# Altium schematic sheet Power+ICs.SchDoc
size 431 x 279 mm; SheetNumber: 1; SheetTotal: 1
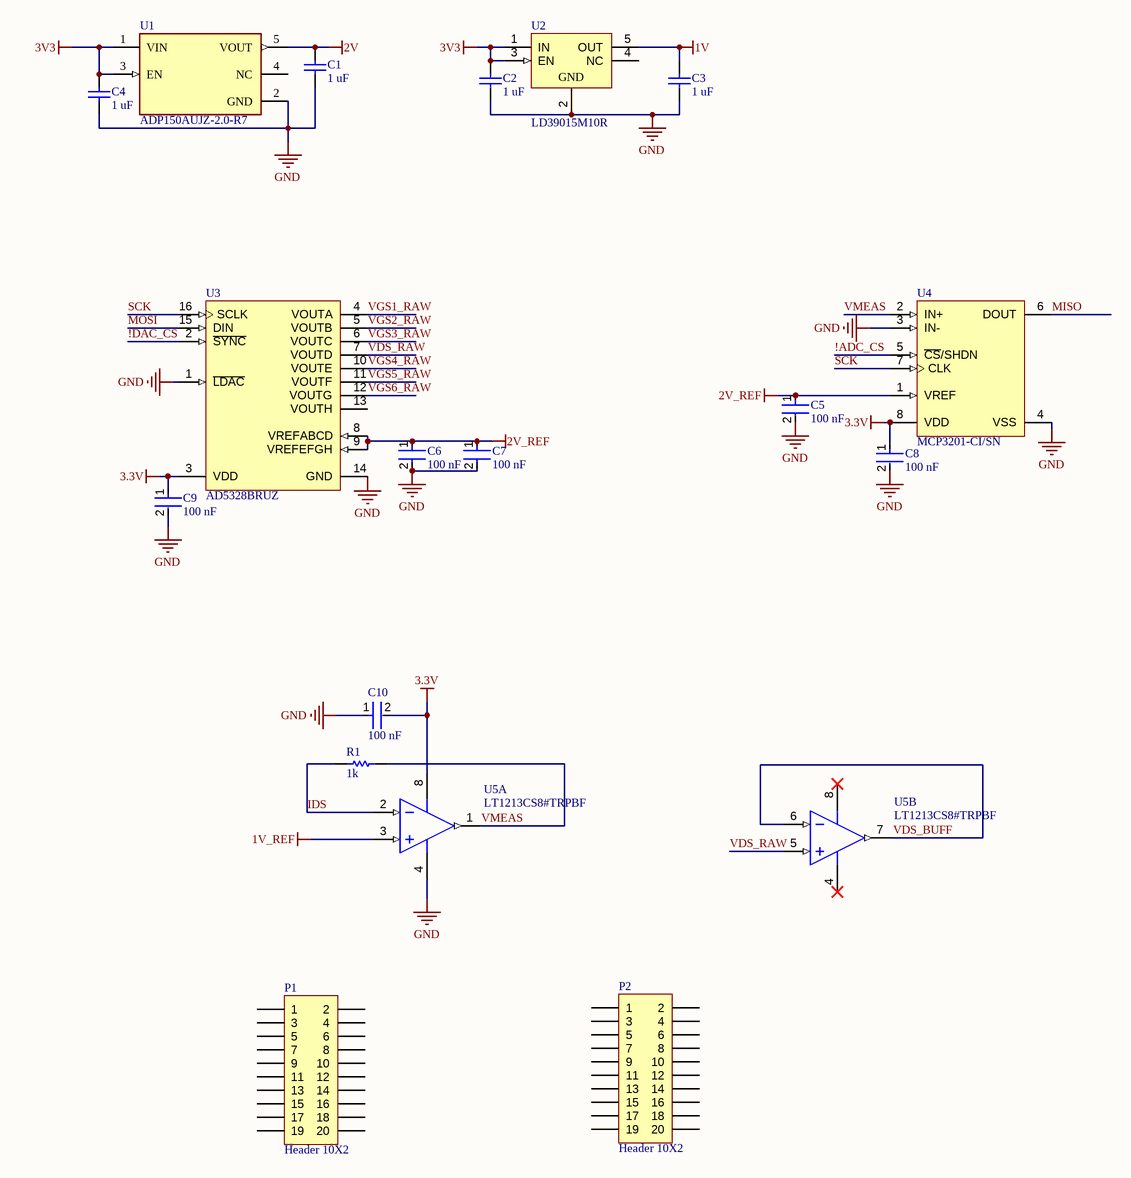
[diagram p0: Power+ICs.SchDoc]

## Parts
C1  1 uF  [CAPC2013X135X45LL10T25]
C2  1 uF  [CAPC2013X135X45LL10T25]
C3  1 uF  [CAPC2013X135X45LL10T25]
C4  1 uF  [CAPC2013X135X45LL10T25]
C5  100 nF  [FP-C0805C-DN-MFG]
C6  100 nF  [FP-C0805C-DN-MFG]
C7  100 nF  [FP-C0805C-DN-MFG]
C8  100 nF  [FP-C0805C-DN-MFG]
C9  100 nF  [FP-C0805C-DN-MFG]
C10  100 nF  [FP-C0805C-DN-MFG]
P1  Header 10X2  [HDR2X10]
P2  Header 10X2  [HDR2X10]
R1  1k  [RESC2013X55X40LL15T20]
U1  ADP150AUJZ-2.0-R7  [FP-UJ-5-IPC_B]
U2  LD39015M10R  [SOT23-5L_M]
U3  AD5328BRUZ  [RU-16_L]
U4  MCP3201-CI/SN  [SOIC-SN8_L]
U5  LT1213CS8#TRPBF  [LT-S8-8_N]  (parts A,B of 2)

## Nets
1V: C3.2 U2.5(OUT)
1V_REF: U5.3(+IN_A)
2V: C1.2 U1.5(VOUT)
2V_REF: C5.1 C6.1 C7.1 U3.8(VREFABCD) U3.9(VREFEFGH) U4.1(VREF)
3.3V: C8.1 C9.1 C10.2 U3.3(VDD) U4.8(VDD) U5.8(V+)
3V3: C2.2 C4.2 U1.1(VIN) U1.3(EN) U2.1(IN) U2.3(EN)
GND: C1.1 C2.1 C3.1 C4.1 C5.2 C6.2 C7.2 C8.2 C9.2 C10.1 U1.2(GND) U2.2(GND) U3.1(~{LDAC}) U3.14(GND) U4.3(IN-) U4.4(VSS) U5.4(V-)
!ADC_CS: U4.5(~{CS}/SHDN)
!DAC_CS: U3.2(~{SYNC})
IDS: R1.1 U5.2(-IN_A)
MISO: U4.6(DOUT)
MOSI: U3.15(DIN)
SCK: U3.16(SCLK) U4.7(CLK)
VDS_BUFF: U5.6(-IN_B) U5.7(OUT_B)
VDS_RAW: U3.7(VOUTD) U5.5(+IN_B)
VGS1_RAW: U3.4(VOUTA)
VGS2_RAW: U3.5(VOUTB)
VGS3_RAW: U3.6(VOUTC)
VGS4_RAW: U3.10(VOUTE)
VGS5_RAW: U3.11(VOUTF)
VGS6_RAW: U3.12(VOUTG)
VMEAS: R1.2 U4.2(IN+) U5.1(OUT_A)

Not connected (* = marked no-connect by the designer): P1 1 2 3 4 5 6 7 8 9 10 11 12 13 14 15 16 17 18 19 20; P2 1 2 3 4 5 6 7 8 9 10 11 12 13 14 15 16 17 18 19 20; U1 4(NC); U2 4(NC); U3 13(VOUTH)

## Notes on the sheet
- DWG. NO.
- REV.
- SHT.
- THIS DOCUMENT AND THE DATA DISCLOSED HEREIN OR HEREWITH IS THE PROPERTY OF ALTIUM LIMITED AND MAY BE FREELY DISTRIBUTED IN WHOLE. NO RIGHTS ARE RESERVED OR EXPRESS OR IMPLIED WARANTEE GIVEN.
- REVISION
- DESCRIPTION
- DATE
- APPROVED
- ENG:
- APPROVALS
- PROJECT
- DSN:
- CHK:
- REFERENCE DOCUMENTS
- PROJECT REVISION:
- TITLE
- DOCUMENT REVISION:
- DESIGN ITEM:
- BOM:
- FAB DWG:
- PCB DWG:
- ASSY DWG:
- SCALE:
- SIZE
- B
- CAGE CODE
- FILE NAME
- DWG NO.
- SHEET
- OF
- REV

## Library data of the parts
C1-C4 = CMP-1036-04761-2: Manufacturer: Murata; Part Number: GRM21BR71H105KA12L
C5-C10 = CMP-2007-00279-2: CAP CER 0.1UF 50V X7R 0805; Manufacturer Part Number: C0805C104K5RACTU; Manufacturer: KEMET; Value: 0.10 μF; Tolerance: 0.1; Temperature Coefficient: 30ppm/°C; Material: Ceramic; Device Class L2: Capacitors; Temperature Range Low: -55°C; Voltage Rating: 50 V; Digikey Description: CAP CER 0.1UF 50V X7R 0805; Category: Cap; ComponentLink2Description: Datasheet; Octopart: https://octopart.com/c0805c104k5ractu-kemet-143926; RoHS: TRUE; ComponentLink2URL: https://content.kemet.com/datasheets/KEM_C1003_C0G_SMD.pdf; Temperature Characteristic: X7R; Temperature: -55°C to +125°C; Height: 0.88mm; Temperature Range High: +125°C; Device Class L1: Passive Components; Automotive: No; Lead Free: Yes; Ipc Land Pattern Name: CAPC200125X78; Device Class L3: Ceramic Capacitors; Mouser Description: Cap Ceramic 0.1uF 50V X7R 10% SMD 2.0 x 1.2 mm 125 C Paper T/R; Capacitance: 0.10 μF; Package: C0805C-DN
P1 P2 = Header 10X2: Header, 10-Pin, Dual row; LatestRevisionDate: 17-Jul-2002; LatestRevisionNote: Re-released for DXP Platform.; Publisher: Altium Limited
R1 = CMP-2001-04738-1: TNPW08051K00BEEN; Manufacturer: Vishay Dale; Part Number: TNPW08051K00BEEN
U1 = CMP-09138-000207-1: IC REG LINEAR 2V 150MA 5TSOT; Dropout Voltage: 105mV; Output Configuration: Positive; Max Input Voltage: 5.5V; Max Supply Current: 320uA; Output Type: Fixed; Min Current Limit: 190mA; Accuracy: 1%; Operating Supply Current: 10uA; Number of Regulators: 1; Quiescent Current: 22uA; Power Supply Rejection Ratio (PSRR): 70dB; Min Input Voltage: 2.2V; Max Operating Temperature: 125°C; Series: -; Min Output Voltage: 2V; Case/Package: SOT-23-5; Packaging: Cut Tape; RoHS Compliant: Yes; Polarity: Positive; Max Output Current: 150mA; Mount: Surface Mount; Number of Pins: 5; Output Voltage: 2V; Contact Plating: Tin; Min Operating Temperature: -40°C; Number of Outputs: 1; Lead Free: Contains Lead; Output Current: 150mA
U2 = CMP-0244-00345-1: 150 mA Low Quiescent Current Low Noise Voltage Regulator, 1.0V, 5-Pin SOT-23, Tape and Reel; ComponentLink2URL: http://www.st.com/internet/com/TECHNICAL_RESOURCES/TECHNICAL_LITERATURE/DATASHEET/CD00173477.pdf; ComponentLink1Description: Manufacturer URL; DatasheetVersion: 1/02/2009; ComponentLink1URL: http://www.st.com; ComponentLink2Description: Datasheet; PackageReference: SOT23-5L; PackageVersion: 1/01/2008; PackageDescription: 5-Pin SOT-23 Package, 2.9 x 1.6 mm Body, 0.95 mm Pitch, 2.8 mm Lead Span
U3 = CMP-0318-02011-2: Octal 12-Bit Voltage Output Digital-to-Analog Converter, 2.5 to 5.5 V, -40 to +125 degC, RU-16, Pb-Free, Tube; Generic Part Number: AD5328; Manufacturer: Analog Devices; Settling Time: 6Âµs; Op Pwr Diss: 5mW; Max V+: 5.5V; Single Supply: Yes; Resolution (Bits): 12; # DAC Outputs: 8; PackageDescription: 16-Lead Thin Shrink Small Outline Package [TSSOP]; ComponentLink3URL: http://www.analog.com/static/imported-files/packages/36244347913743854010197452789RU16.pdf; DatasheetVersion: Rev.F; ComponentLink2Description: Datasheet; Mounting Technology: Surface Mount; ComponentLink4URL: http://www.analog.com/en/digital-to-analog-converters/da-converters/ad5328/products/product.html; RevisionNote: Component URL fixed; PackageVersion: Nov-2002; PackageReference: RU-16; ComponentLink1URL: http://www.analog.com/en/index.html; ComponentLink4Description: Product URL; ComponentLink1Description: Manufacturer URL; Packing: Tube; ComponentLink2URL: http://www.analog.com/static/imported-files/data_sheets/AD5308_5318_5328.pdf; RoHS: Y; ComponentLink3Description: Package Specification; Code_JEDEC: MO-153-AB; PartNumber: AD5328BRUZ
U4 = CMP-0188-00469-2: 2.7V 12-Bit A/D Converter with SPI Serial Interface, 8-Pin SOIC 150mil, C Performance Grade, Industrial Temperature; ComponentLink1URL: http://www.microchip.com/; DatasheetVersion: revF, Aug-2011; RevisionNote: URLs added. DatasheetVersion updated.; Code_IPC: SOIC127P600-8; ComponentLink3URL: http://www.microchip.com/stellent/groups/techpub_sg/documents/packagingspec/en012702.pdf; ComponentLink3Description: Package Specification; ComponentLink2URL: http://ww1.microchip.com/downloads/en/DeviceDoc/21290F.pdf; PackageReference: SOIC-SN8; ComponentLink1Description: Manufacturer URL; ComponentLink2Description: Datasheet; PackageVersion: revBB, Aug-2009; Code_JEDEC: MS-012; PackageDescription: 8-Lead Plastic Small Outline (SN) - Narrow, 3.90mm Body [SOIC]
U5 = CMP-0359-03127-2: Dual Channel, Precision, Fast Operational Amplifier, 28 MHz Typical GBW, 8.5 V/us Typical SR, 2.5 to 36 V, 8-Pin SOIC (S8-8), Commercial, Pb-Free, Reel; Linear Technology Part Number: LT1213; Manufacturer: Linear Technology; Vos (mV) Typical: 0.075; Vs Max (V): 36; SR (V/us) Typical: 8.5; GBW (MHz) Typical: 28; Vs Min (V): 2.5; Is (mA) Typical: 2.7; Channels (#): 2; ComponentLink2Description: Datasheet; ComponentLink1Description: Manufacturer URL; RoHS: Pb-Free; DatasheetVersion: Rev. A; RevisionNote: URLs updated; Packing: Reel; ComponentLink3Description: Package Specification; ComponentLink2URL: http://cds.linear.com/docs/en/datasheet/12134fa.pdf; ComponentLink3URL: http://cds.linear.com/docs/en/packaging/05081610_G_SO8.pdf; Mounting Technology: Surface Mount; Type: VFB; PartNumber: LT1213CS8#TRPBF; PackageDescription: 8-Pin Plastic Small Outline, Body 4.9 x 3.9 mm, Pitch 1.27 mm; ComponentLink1URL: http://www.linear.com/; PackageVersion: Rev G; PackageReference: LT-S8-8